# EAGLE design robot_systems (EAGLE 6.1)
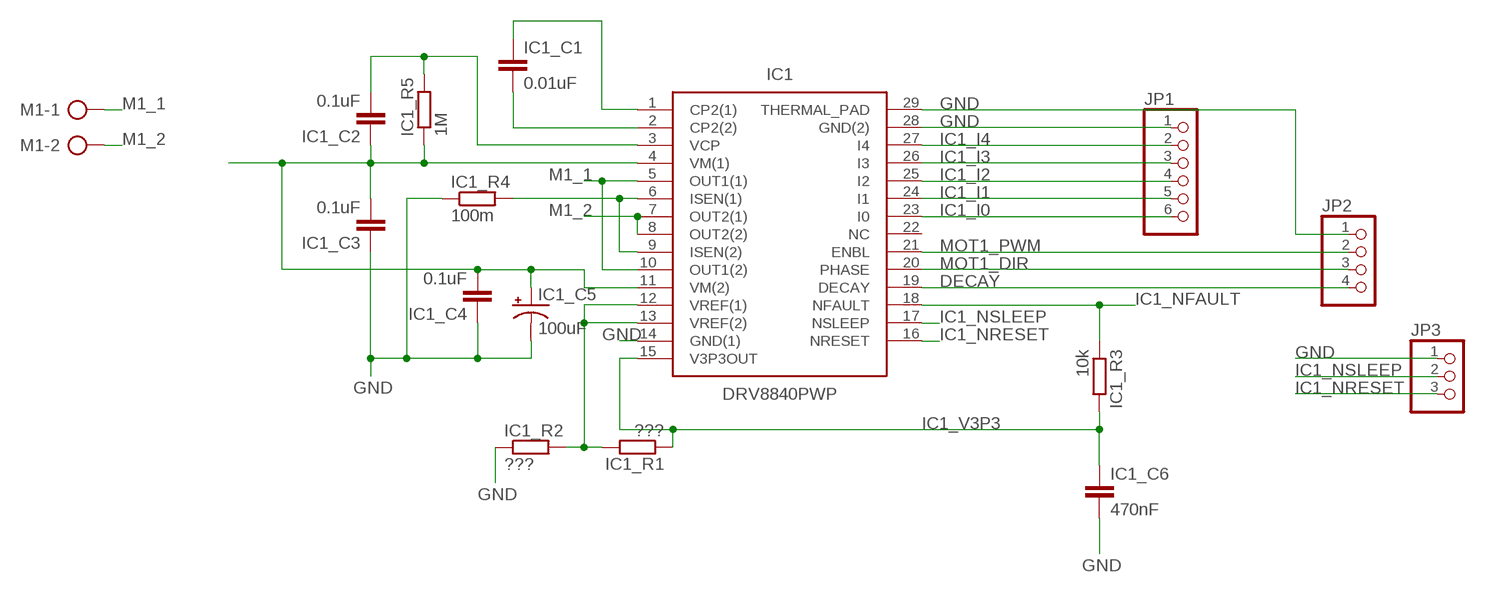
[diagram p0: schematic, sheet 1]

## Parts
IC1  DRV8840PWP  [SOP65P640X120-29N]
IC1_C1  0.01uF  C-EUC0603  [C0603]
IC1_C2  0.1uF  CAP0805  [0805]
IC1_C3  0.1uF  CAP0805  [0805]
IC1_C4  0.1uF  CAP1206  [1206]
IC1_C5  100uF  CAP_POL7343  [EIA7343]
IC1_C6  470nF  C-EUC0603  [C0603]
IC1_R1  ???  R-EU_0204/5  [0204/5]
IC1_R2  ???  R-EU_0204/5  [0204/5]
IC1_R3  10k  R-EU_R2010  [R2010]
IC1_R4  100m  R-EU_R2512  [R2512]
IC1_R5  1M  R-EU_R0603  [R0603]
JP1  PINHD-1X6  [1X06]
JP2  PINHD-1X4  [1X04]
JP3  PINHD-1X3  [1X03]
M1  AK500/2  [AK500/2]

## Nets
12V2: IC1.4(VM(1)) IC1.11(VM(2)) IC1_C2.1 IC1_C3.2 IC1_C4.2 IC1_C5.A(+) IC1_R5.1
DECAY: IC1.19(DECAY) JP2.4
GND: IC1.14(GND(1)) IC1.28(GND(2)) IC1.29(THERMAL_PAD) IC1_C3.1 IC1_C4.1 IC1_C5.C(-) IC1_C6.2 IC1_R2.1 IC1_R4.1 JP1.1 JP2.1 JP3.1
IC1_I0: IC1.23(I0) JP1.6
IC1_I1: IC1.24(I1) JP1.5
IC1_I2: IC1.25(I2) JP1.4
IC1_I3: IC1.26(I3) JP1.3
IC1_I4: IC1.27(I4) JP1.2
IC1_NFAULT: IC1.18(NFAULT) IC1_R3.1
IC1_NRESET: IC1.16(NRESET) JP3.3
IC1_NSLEEP: IC1.17(NSLEEP) JP3.2
IC1_V3P3: IC1.15(V3P3OUT) IC1_C6.1 IC1_R1.1 IC1_R3.2
M1_1: IC1.5(OUT1(1)) IC1.10(OUT1(2)) M1.1
M1_2: IC1.7(OUT2(1)) IC1.8(OUT2(2)) M1.2
MOT1_DIR: IC1.20(PHASE) JP2.3
MOT1_PWM: IC1.21(ENBL) JP2.2
N$2: IC1.12(VREF(1)) IC1.13(VREF(2)) IC1_R1.2 IC1_R2.2
N$5: IC1.6(ISEN(1)) IC1.9(ISEN(2)) IC1_R4.2
N$10: IC1.1(CP2(1)) IC1_C1.1
N$11: IC1.2(CP2(2)) IC1_C1.2
N$12: IC1.3(VCP) IC1_C2.2 IC1_R5.2
Unconnected: IC1.22(NC)

## Library data of the parts
IC1 = DRV8840PWP:DRV8840PWP: Texas Instruments DRV8840PWP, Full Bridge Motor Driver, DC Motor Driver, 28-Pin HTSSOP <https://componentsearchengine.com/Images/3/DRV8840PWP.jpg> Source: Datasheet <http://www.ti.com/lit/ds/symlink/drv8840.pdf>; DESCRIPTION: Texas Instruments DRV8840PWP, Full Bridge Motor Driver, DC Motor Driver, 28-Pin HTSSOP; HEIGHT: 1.2mm; MANUFACTURER_NAME: Texas Instruments; MANUFACTURER_PART_NUMBER: DRV8840PWP; RS_PART_NUMBER: 7385440; SUPPLIER_NAME: RS
IC1_C1 IC1_C6 = rcl:C-EU: CAPACITOR, European symbol
IC1_C2-IC1_C4 = SparkFun-Passives:CAP: Capacitor Standard 0603 ceramic capacitor, and 0.1" leaded capacitor.
IC1_C5 = SparkFun-Passives:CAP_POL: Capacitor Polarized These are standard SMD and PTH capacitors. Normally 10uF, 47uF, and 100uF in electrolytic and tantalum varieties. Always verify the external diameter of the through hole cap, it varies with capacity, voltage, and manufacturer. The EIA devices should be standard.
IC1_R1 IC1_R2 = resistor:R-EU_: RESISTOR, European symbol
IC1_R3-IC1_R5 = rcl:R-EU_: RESISTOR, European symbol
JP1 = pinhead:PINHD-1X6: PIN HEADER
JP2 = pinhead:PINHD-1X4: PIN HEADER
JP3 = pinhead:PINHD-1X3: PIN HEADER
M1 = con-ptr500:AK500/2: CONNECTOR; OC_FARNELL: unknown; OC_NEWARK: unknown

## Board
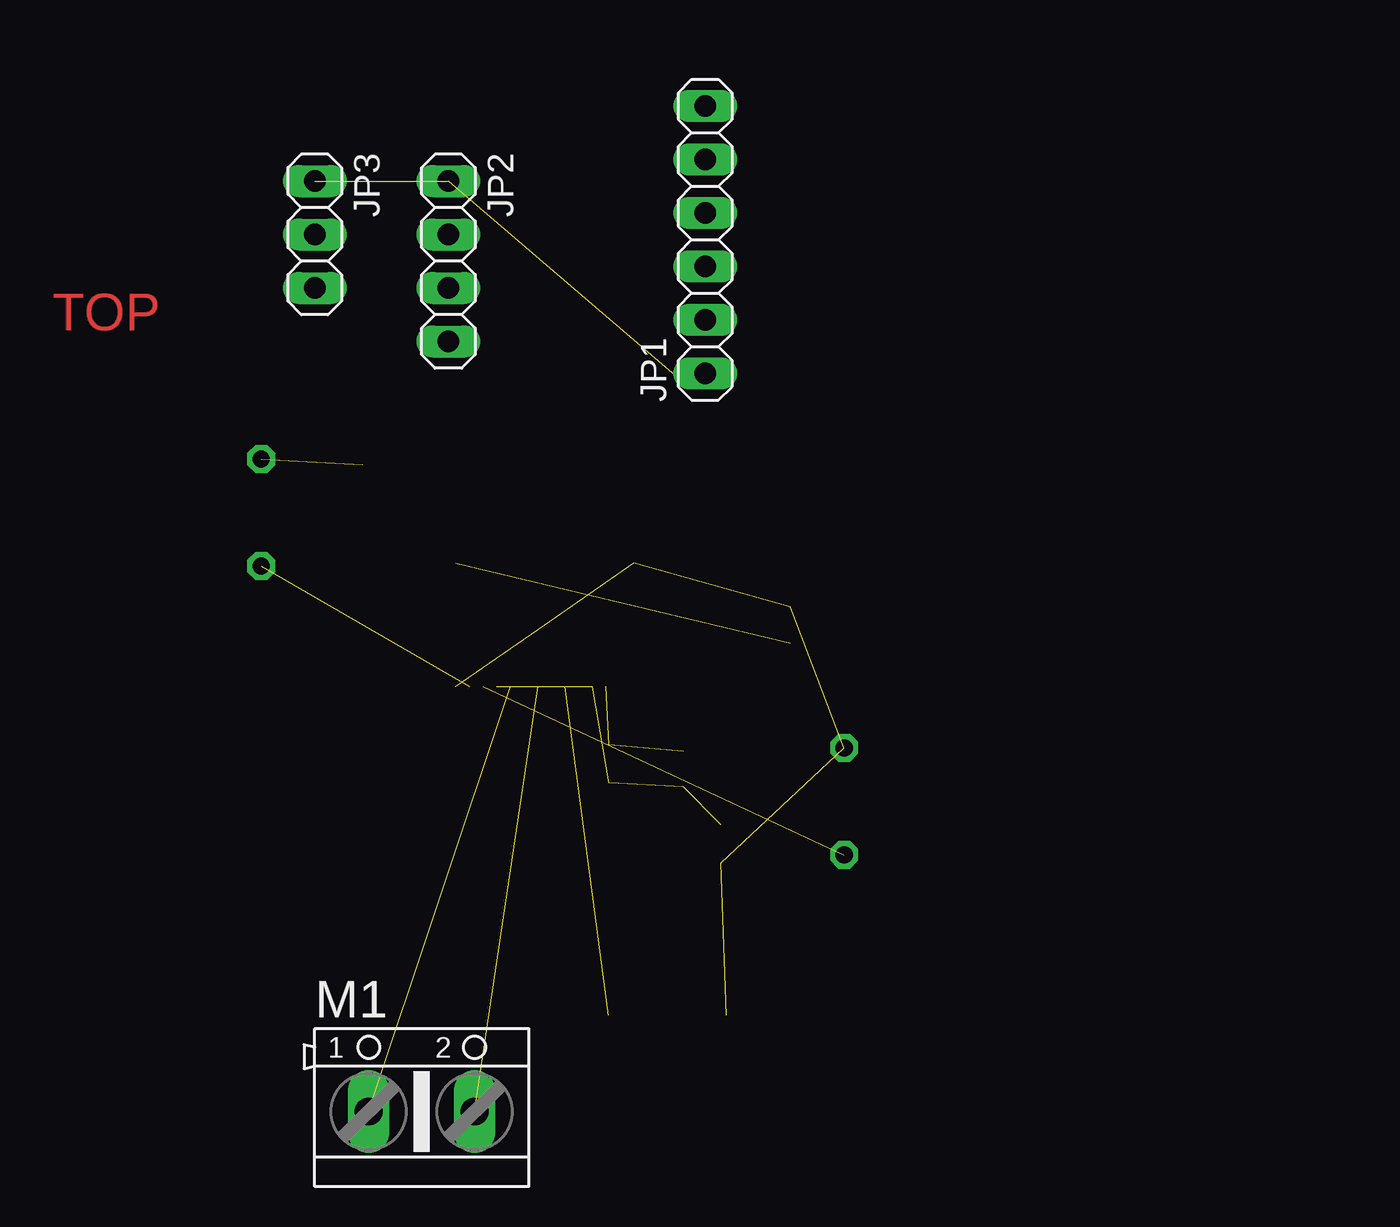
[diagram p1: board, top side]
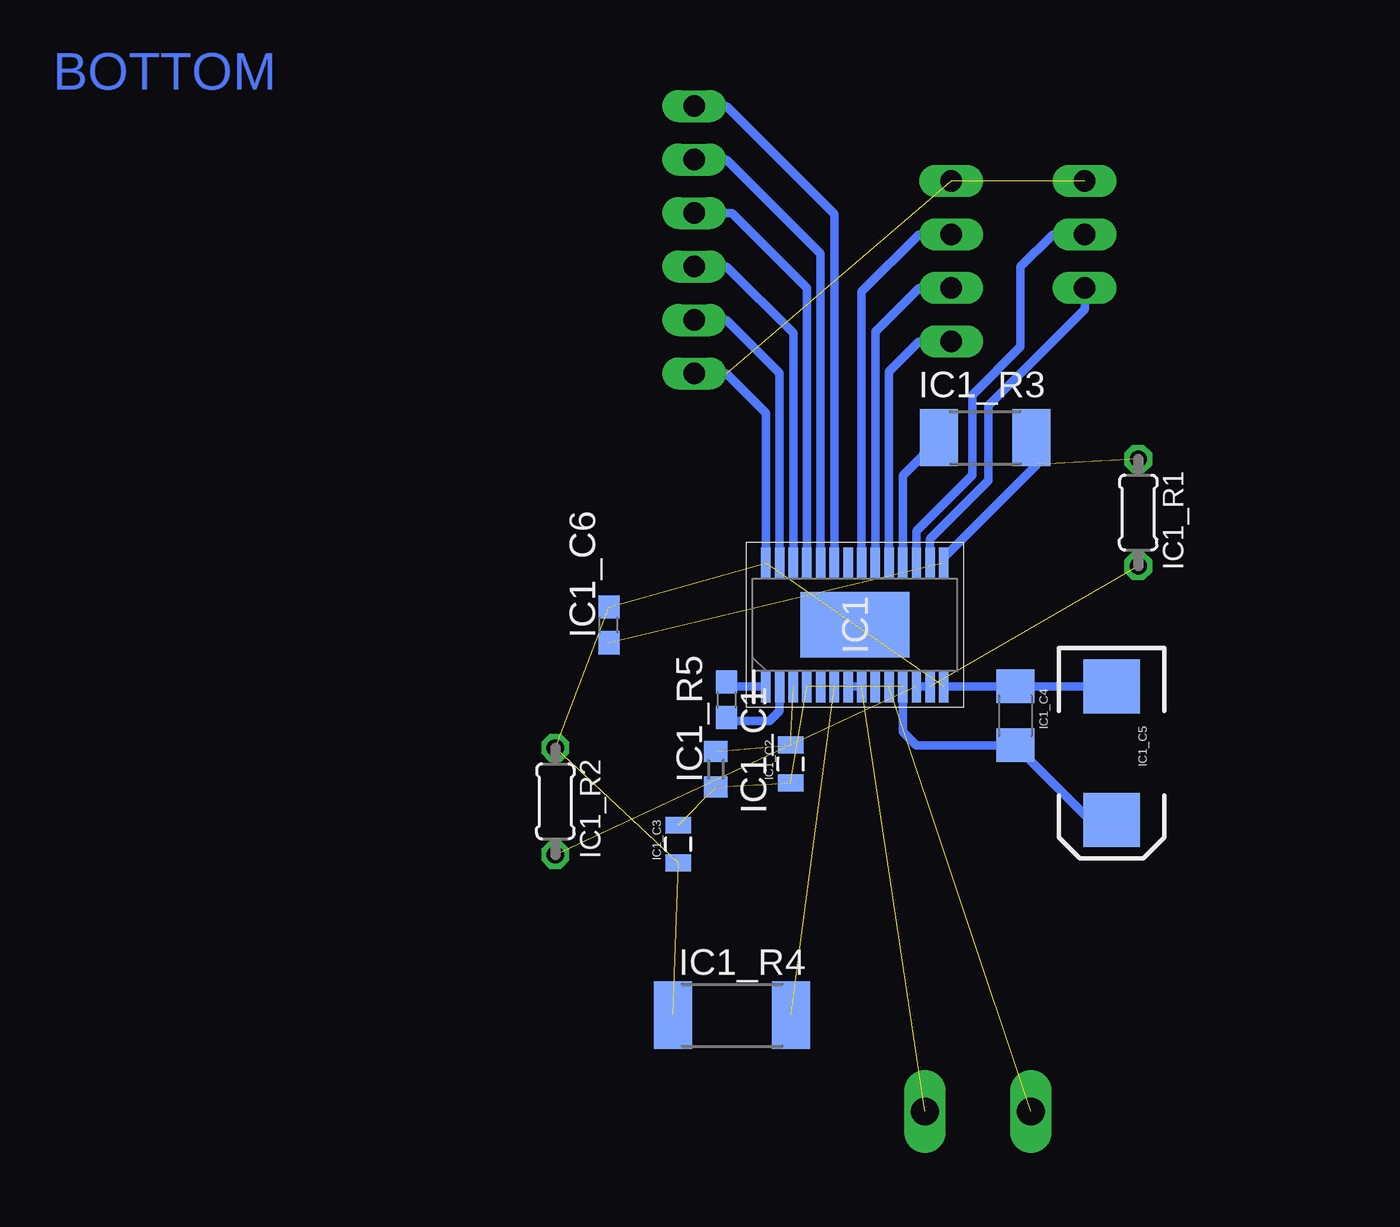
[diagram p2: board, bottom side, seen from below]

No outline drawn. Coordinates in mm, seen from the top.
Copper layers (1*16): Top 0.035mm / dielectric 1.5mm / Bottom 0.035mm
Design rules: minimum track width 15mil, minimum drill 0.35mm, track to track 10mil, track to pad 10mil, pad to pad 10mil, via to via 6mil, smd to smd 6mil, copper to edge 40mil, drill to drill 6mil, minimum pad ring 10mil, minimum via ring 8mil, stop-mask expansion 4mil, vias tented up to drill 0mil, thermal gap 10mil

### Footprints (pad centres in the part's own frame; a part is rotated, then mirrored left to right if it is on the bottom)
SOP65P640X120-29N = smd 1.475 x 0.45: 1 -2.938,4.225; 2 -2.938,3.575; 3 -2.938,2.925; 4 -2.938,2.275; 5 -2.938,1.625; 6 -2.938,0.975; 7 -2.938,0.325; 8 -2.938,-0.325; 9 -2.938,-0.975; 10 -2.938,-1.625; 11 -2.938,-2.275; 12 -2.938,-2.925; 13 -2.938,-3.575; 14 -2.938,-4.225; 15 2.938,-4.225; 16 2.938,-3.575; 17 2.938,-2.925; 18 2.938,-2.275; 19 2.938,-1.625; 20 2.938,-0.975; 21 2.938,-0.325; 22 2.938,0.325; 23 2.938,0.975; 24 2.938,1.625; 25 2.938,2.275; 26 2.938,2.925; 27 2.938,3.575; 28 2.938,4.225 | smd 3.1 x 5.18: 29 0,0
C0603 = smd 1.1 x 1: 1 -0.85,0; 2 0.85,0
0805 = smd 0.8 x 1.2: 1 -0.9,0; 2 0.9,0
1206 = smd 1.6 x 1.8: 1 -1.4,0; 2 1.4,0
EIA7343 = smd 2.55 x 2.7: A 3.17,0; C -3.17,0
0204/5 = drill 0.813 octagon: 1 -2.54,0; 2 2.54,0
R2010 = smd 1.8 x 2.7: 1 -2.2,0; 2 2.2,0
R2512 = smd 1.8 x 3.2: 1 -2.8,0; 2 2.8,0
R0603 = smd 1 x 1.1: 1 -0.85,0; 2 0.85,0
1X06 = drill 1.016 long: 1 -6.35,0; 2 -3.81,0; 3 -1.27,0; 4 1.27,0; 5 3.81,0; 6 6.35,0
1X04 = drill 1.016 long: 1 -3.81,0; 2 -1.27,0; 3 1.27,0; 4 3.81,0
1X03 = drill 1.016 long: 1 -2.54,0; 2 0,0; 3 2.54,0
AK500/2 = drill 1.321 long: 1 -2.515,0; 2 2.515,0

### Placement (x,y rotation side)
IC1  18.03,18.29 90 bottom
IC1_C1  24.13,14.73 270 bottom
IC1_C2  21.08,11.68 90 bottom
IC1_C3  26.42,7.87 90 bottom
IC1_C4  10.41,13.97 270 bottom
IC1_C5  5.84,12.19 270 bottom
IC1_C6  29.72,18.29 90 bottom
IC1_R1  4.57,23.62 270 bottom
IC1_R2  32.26,9.91 270 bottom
IC1_R3  11.85,27.18 0 bottom
IC1_R4  23.88,-0.25 0 bottom
IC1_R5  24.64,11.43 90 bottom
JP1  25.65,36.58 90 top
JP2  13.46,35.56 270 top
JP3  7.11,36.83 270 top
M1  12.19,-4.83 0 top

### Tracks (layer width: path | path; a pad name or v marks a point on that pad's centre or on a via)
12V2  (4 unrouted)
  Bottom 0.406: IC1_C5.A 6.87,9.02 IC1_C4.2 15.11,12.57 15.75,13.21 15.75,15.34 IC1.11
DECAY
  Bottom 0.406: IC1.19 16.41,30.33 14.99,31.75 JP2.4
GND  (8 unrouted)
  Bottom 0.406: IC1.28 22.26,28.36 24.13,30.23 JP1.1 | IC1.14 10.43,15.35 IC1_C4.1 IC1_C5.C
IC1_I0
  Bottom 0.406: IC1.23 19.01,37.8 24.13,42.93 JP1.6
IC1_I1
  Bottom 0.406: IC1.24 19.66,35.91 24.13,40.39 JP1.5
IC1_I2
  Bottom 0.406: IC1.25 20.31,34.28 23.88,37.85 JP1.4
IC1_I3
  Bottom 0.406: IC1.26 20.96,32.13 24.13,35.31 JP1.3
IC1_I4
  Bottom 0.406: IC1.27 21.61,30.25 24.13,32.77 JP1.2
IC1_NFAULT
  Bottom 0.406: IC1.18 15.76,25.39 13.97,27.18 IC1_R3.1
IC1_NRESET
  Bottom 0.406: IC1.16 14.46,22.37 11.68,25.15 11.68,28.7 7.11,33.27 JP3.3
IC1_NSLEEP
  Bottom 0.406: IC1.17 15.11,22.74 12.45,25.4 12.45,29.21 10.16,31.5 10.16,35.31 8.64,36.83 JP3.2
IC1_V3P3  (2 unrouted)
  Bottom 0.406: IC1.15 13.81,21.5 9.4,25.91 9.4,26.93 IC1_R3.2
M1_1  (2 unrouted)
M1_2  (1 unrouted)
  Bottom 0.406: IC1.8 IC1.7
MOT1_DIR
  Bottom 0.406: IC1.20 17.06,32.22 14.99,34.29 JP2.3
MOT1_PWM
  Bottom 0.406: IC1.21 17.71,34.11 14.99,36.83 JP2.2
N$2  (2 unrouted)
  Bottom 0.406: IC1.13 IC1.12
N$5  (2 unrouted)
N$10
  Bottom 0.406: IC1.1 23.9,15.35 IC1_C1.1
N$11
  Bottom 0.406: IC1.2 21.61,14.21 22.1,13.72 23.96,13.72 IC1_C1.2
N$12  (2 unrouted)

### Text on the board
Top: TOP
Bottom: BOTTOM